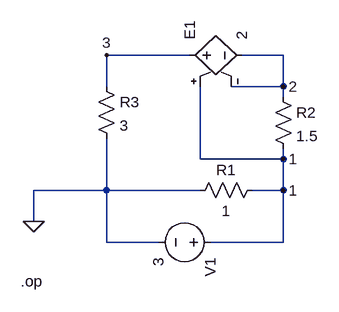
[diagram p0: schematic Draft1.asc]
Draft1.asc, the LTspice schematic file:
Version 4
SHEET 1 880 680
WIRE -80 -352 -208 -352
WIRE 64 -352 0 -352
WIRE -208 -304 -208 -352
WIRE 64 -304 64 -352
WIRE 64 -304 -16 -304
WIRE 64 -288 64 -304
WIRE -64 -192 -64 -304
WIRE 64 -192 64 -208
WIRE 64 -192 -64 -192
WIRE -208 -144 -208 -224
WIRE -208 -144 -320 -144
WIRE -64 -144 -208 -144
WIRE 64 -144 64 -192
WIRE 64 -144 16 -144
WIRE -320 -96 -320 -144
WIRE -208 -64 -208 -144
WIRE -128 -64 -208 -64
WIRE 64 -64 64 -144
WIRE 64 -64 -48 -64
FLAG -320 -96 0
FLAG 64 -144 1
FLAG 64 -304 2
FLAG -208 -352 3
FLAG 64 -192 1
SYMBOL voltage -32 -64 R90
WINDOW 123 0 0 Left 0
WINDOW 39 0 0 Left 0
SYMATTR InstName V1
SYMATTR Value 3
SYMBOL res 32 -160 R90
WINDOW 0 0 56 VBottom 2
WINDOW 3 32 56 VTop 2
SYMATTR InstName R1
SYMATTR Value 1
SYMBOL res 48 -304 R0
SYMATTR InstName R2
SYMATTR Value 1.5
SYMBOL e -96 -352 R270
SYMATTR InstName E1
SYMATTR Value 2
SYMBOL res -224 -320 R0
SYMATTR InstName R3
SYMATTR Value 3
TEXT -340 -4 Left 2 !.op

The netlist it stands for:
* Draft1.asc
V1 1 0 3
R1 1 0 1
R2 2 1 1.5
E1 3 2 1 2 2
R3 3 0 3
.op
.backanno
.end

* Results of the author's LTspice run, read from the files saved beside the schematic
* Operating Point:
*   V(1) = 3 V
*   V(2) = 0 V
*   V(3) = 6 V
*   I(R3) = 2 A
*   I(R2) = -2 A
*   I(R1) = 3 A
*   I(E1) = -2 A
*   I(V1) = -5 A